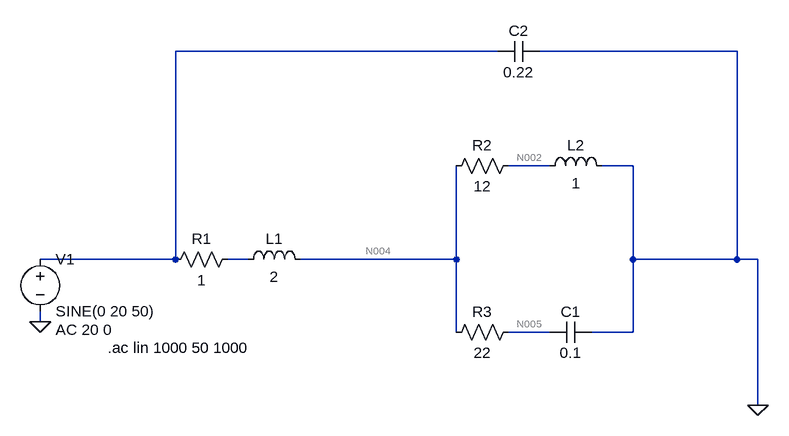
[diagram p0: schematic Draft1.asc]
Draft1.asc, the LTspice schematic file:
Version 4.1
SHEET 1 916 680
WIRE 496 -160 0 -160
WIRE 864 -160 560 -160
WIRE 576 16 512 16
WIRE 704 16 656 16
WIRE 0 160 0 -160
WIRE 0 160 -208 160
WIRE 112 160 80 160
WIRE 432 160 432 16
WIRE 432 160 192 160
WIRE 704 160 704 16
WIRE 864 160 864 -160
WIRE 864 160 704 160
WIRE 896 160 864 160
WIRE -208 256 -208 240
WIRE 432 272 432 160
WIRE 576 272 512 272
WIRE 704 272 704 160
WIRE 704 272 640 272
WIRE 896 384 896 160
FLAG 896 384 0
FLAG -208 256 0
SYMBOL res 96 144 R90
WINDOW 0 0 56 VBottom 2
WINDOW 3 32 56 VTop 2
SYMATTR InstName R1
SYMATTR Value 1
SYMBOL res 528 0 R90
WINDOW 0 0 56 VBottom 2
WINDOW 3 32 56 VTop 2
SYMATTR InstName R2
SYMATTR Value 12
SYMBOL res 528 256 R90
WINDOW 0 0 56 VBottom 2
WINDOW 3 32 56 VTop 2
SYMATTR InstName R3
SYMATTR Value 22
SYMBOL ind 96 176 R270
WINDOW 0 32 56 VTop 2
WINDOW 3 5 56 VBottom 2
SYMATTR InstName L1
SYMATTR Value 2
SYMATTR SpiceLine Rser=1m
SYMBOL ind 560 32 R270
WINDOW 0 32 56 VTop 2
WINDOW 3 5 56 VBottom 2
SYMATTR InstName L2
SYMATTR Value 1
SYMATTR SpiceLine Rser=1m
SYMBOL cap 640 256 R90
WINDOW 0 0 32 VBottom 2
WINDOW 3 32 32 VTop 2
SYMATTR InstName C1
SYMATTR Value 0.1
SYMBOL cap 560 -176 R90
WINDOW 0 0 32 VBottom 2
WINDOW 3 32 32 VTop 2
SYMATTR InstName C2
SYMATTR Value 0.22
SYMBOL voltage -208 144 R0
WINDOW 123 24 124 Left 2
WINDOW 39 0 0 Left 0
SYMATTR Value2 AC 20 0
SYMATTR InstName V1
SYMATTR Value SINE(0 20 50)
TEXT -104 296 Left 2 !.ac lin 1000 50 1000

The netlist it stands for:
* Draft1.asc
R1 N003 N001 1
R2 N002 N004 12
R3 N005 N004 22
L1 N003 N004 2 Rser=1m
L2 N002 0 1 Rser=1m
C1 0 N005 0.1
C2 0 N001 0.22
V1 N001 0 SINE(0 20 50) AC 20 0
.ac lin 1000 50 1000
.backanno
.end

* Results of the author's LTspice run, read from the files saved beside the schematic
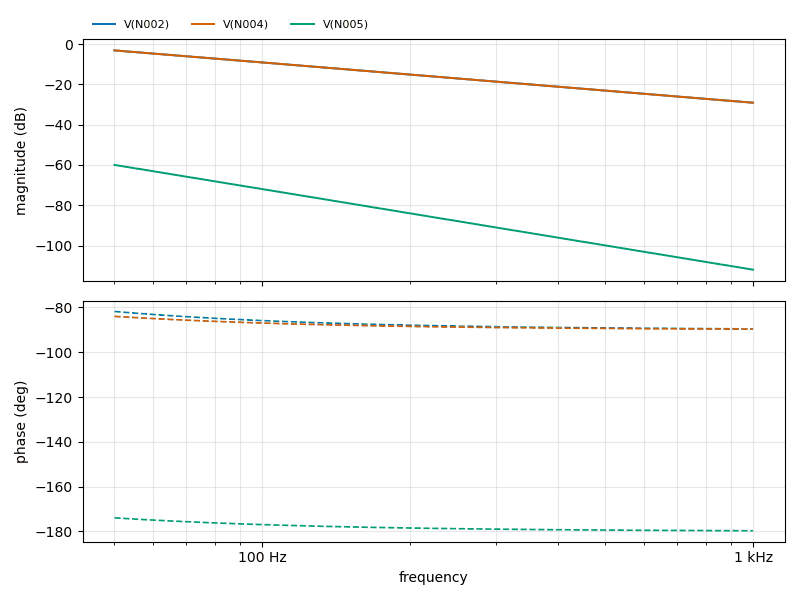
[diagram p1: AC Analysis of Draft1.asc, plotted from the saved traces]
* AC Analysis, 1 run:
*   V(N002): -3.17 dB at 50 Hz, -29.12 dB at 1 kHz, peak -3.17 dB at 50 Hz, 3 dB below the peak at 71.02 Hz
*   V(N004): -3.16 dB at 50 Hz, -29.12 dB at 1 kHz, peak -3.16 dB at 50 Hz, 3 dB below the peak at 71 Hz
*   V(N005): -59.96 dB at 50 Hz, -111.93 dB at 1 kHz, peak -59.96 dB at 50 Hz, 3 dB below the peak at 59.53 Hz